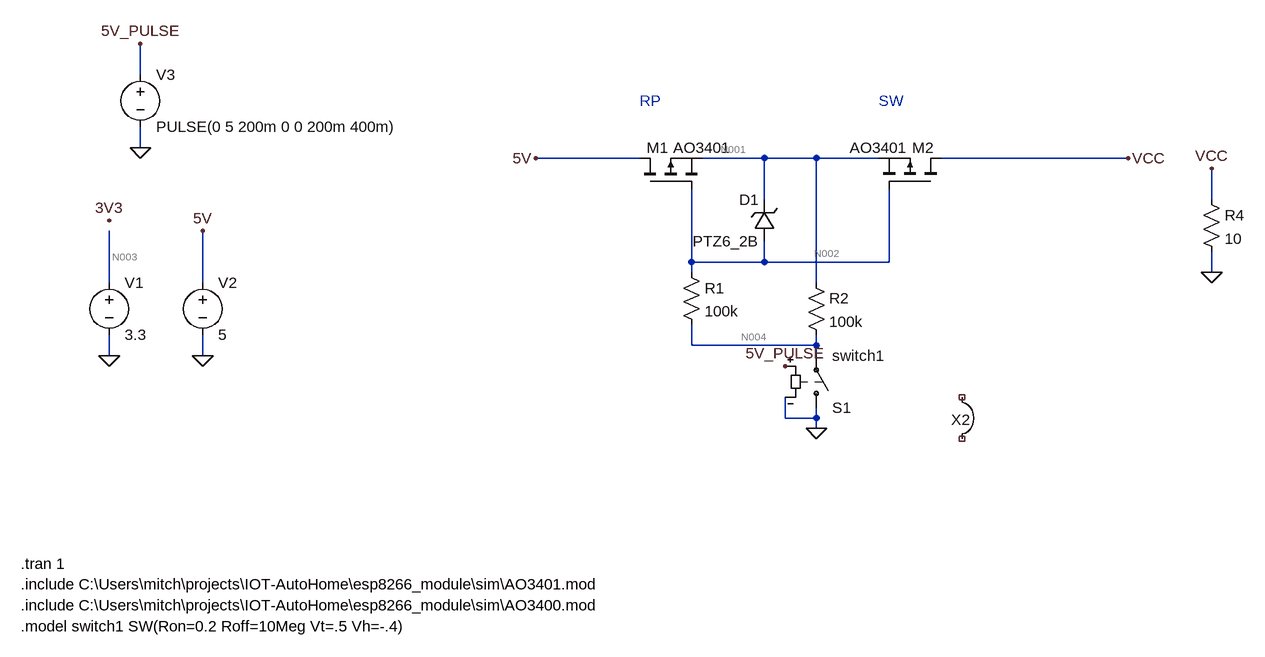
[diagram p0: schematic usb_pwr_sel.asc]
usb_pwr_sel.asc, the LTspice schematic file:
Version 4
SHEET 1 1272 688
WIRE -496 -176 -496 -224
WIRE -496 -64 -496 -96
WIRE 272 -48 112 -48
WIRE 464 -48 368 -48
WIRE 544 -48 464 -48
WIRE 640 -48 544 -48
WIRE 1024 -48 736 -48
WIRE 464 16 464 -48
WIRE 1152 16 1152 -32
WIRE 352 112 352 0
WIRE 464 112 464 80
WIRE 464 112 352 112
WIRE 656 112 656 0
WIRE 656 112 464 112
WIRE 352 128 352 112
WIRE 1152 128 1152 96
WIRE -544 144 -544 64
WIRE -400 144 -400 64
WIRE 544 144 544 -48
WIRE 352 240 352 208
WIRE 544 240 544 224
WIRE 544 240 352 240
WIRE -544 256 -544 224
WIRE -400 256 -400 224
WIRE 544 256 544 240
WIRE 496 352 496 320
WIRE 544 352 544 336
WIRE 544 352 496 352
WIRE 544 368 544 352
FLAG -544 48 3V3
FLAG -400 256 0
FLAG -400 64 5V
FLAG 1152 128 0
FLAG -496 -224 5V_PULSE
FLAG -496 -64 0
FLAG -544 256 0
FLAG 1152 -32 VCC
FLAG 1024 -48 VCC
FLAG 112 -48 5V
FLAG 544 368 0
FLAG 496 272 5V_PULSE
SYMBOL voltage -544 128 R0
WINDOW 123 0 0 Left 0
WINDOW 39 0 0 Left 0
SYMATTR InstName V1
SYMATTR Value 3.3
SYMBOL voltage -400 128 R0
WINDOW 123 0 0 Left 0
WINDOW 39 0 0 Left 0
SYMATTR InstName V2
SYMATTR Value 5
SYMBOL res 1136 0 R0
SYMATTR InstName R4
SYMATTR Value 10
SYMBOL voltage -496 -192 R0
WINDOW 123 0 0 Left 0
WINDOW 39 0 0 Left 0
SYMATTR InstName V3
SYMATTR Value PULSE(0 5 200m 0 0 200m 400m)
SYMBOL pmos 272 0 R270
WINDOW 3 56 72 Invisible 2
WINDOW 38 64 52 VRight 2
WINDOW 0 64 11 VRight 2
SYMATTR Value ""
SYMATTR SpiceModel AO3401
SYMATTR InstName M1
SYMATTR Prefix X
SYMBOL zener 480 80 R180
WINDOW 0 24 64 Left 2
WINDOW 3 24 0 Left 2
SYMATTR InstName D1
SYMATTR Value PTZ6_2B
SYMBOL res 336 112 R0
SYMATTR InstName R1
SYMATTR Value 100k
SYMBOL pmos 736 0 M270
WINDOW 3 56 72 Invisible 2
WINDOW 38 64 52 VRight 2
WINDOW 0 64 11 VRight 2
SYMATTR Value ""
SYMATTR SpiceModel AO3401
SYMATTR InstName M2
SYMATTR Prefix X
SYMBOL Misc\\jumper 832 352 R90
WINDOW 0 -13 66 VTop 2
SYMATTR InstName X2
SYMBOL res 528 128 R0
SYMATTR InstName R2
SYMATTR Value 100k
SYMBOL sw 544 352 M180
SYMATTR InstName S1
SYMATTR Value switch1
TEXT -680 608 Left 2 !.include C:\\Users\\mitch\\projects\\IOT-AutoHome\\esp8266_module\\sim\\AO3401.mod
TEXT -680 576 Left 2 !.tran 1
TEXT -680 640 Left 2 !.include C:\\Users\\mitch\\projects\\IOT-AutoHome\\esp8266_module\\sim\\AO3400.mod
TEXT 272 -136 Left 2 ;RP
TEXT 640 -136 Left 2 ;SW
TEXT -680 672 Left 2 !.model switch1 SW(Ron=0.2 Roff=10Meg Vt=.5 Vh=-.4)

The netlist it stands for:
* usb_pwr_sel.asc
V1 N003 0 3.3
V2 5V 0 5
R4 VCC 0 10
V3 5V_PULSE 0 PULSE(0 5 200m 0 0 200m 400m)
XM1 5V N002 N001 AO3401  ; pins D G S
D1 N002 N001 PTZ6_2B
R1 N002 N004 100k
XM2 VCC N002 N001 AO3401  ; pins D G S
R2 N001 N004 100k
S1 0 N004 5V_PULSE 0 switch1
.model D D
.lib standard.dio
.include C:\Users\mitch\projects\IOT-AutoHome\esp8266_module\sim\AO3401.mod
.tran 1
.include C:\Users\mitch\projects\IOT-AutoHome\esp8266_module\sim\AO3400.mod
* RP
* SW
.model switch1 SW(Ron=0.2 Roff=10Meg Vt=.5 Vh=-.4)
.backanno
.end

* Results of the author's LTspice run, read from the files saved beside the schematic
* Operating Point, zero values left out:
*   V(n003) = 3.3 V
*   V(5v) = 5 V
*   V(n001) = 4.722 V
*   V(n002) = 4.675 V
*   V(n004) = 4.675 V
*   I(D1) = -51.08 pA
*   I(R2) = 467.5 nA
*   I(R1) = 51.41 pA
*   I(R4) = 33.63 pA
*   I(S1) = 467.5 nA
*   I(V2) = -467.6 nA
*   Ix(m1:4) = 467.6 nA
*   Ix(m1:2) = -467.6 nA
*   Ix(m2:4) = -33.63 pA
*   Ix(m2:2) = 35.53 pA
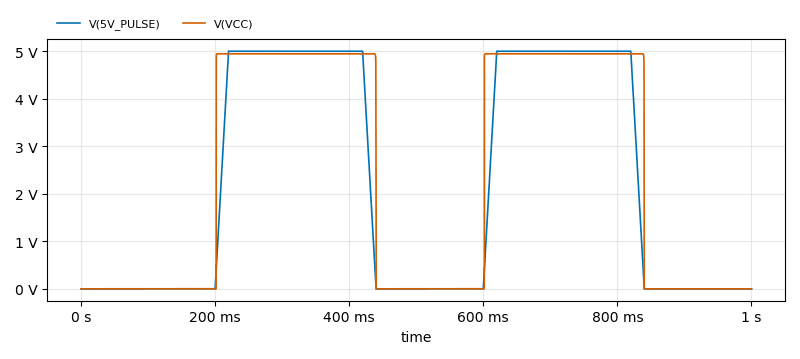
[diagram p1: Transient Analysis of usb_pwr_sel.asc, plotted from the saved traces]
* Transient Analysis, 1 run:
*   V(5V_PULSE): min 0 V, max 5 V, average 2.2 V, rms 3.284 V, last 0 V
*   V(VCC): min -588.4 nV, max 4.946 V, average 2.357 V, rms 3.414 V, last 0 V